# Altium project USB_Oscilloscope.PrjPcb (part 1 of 2)
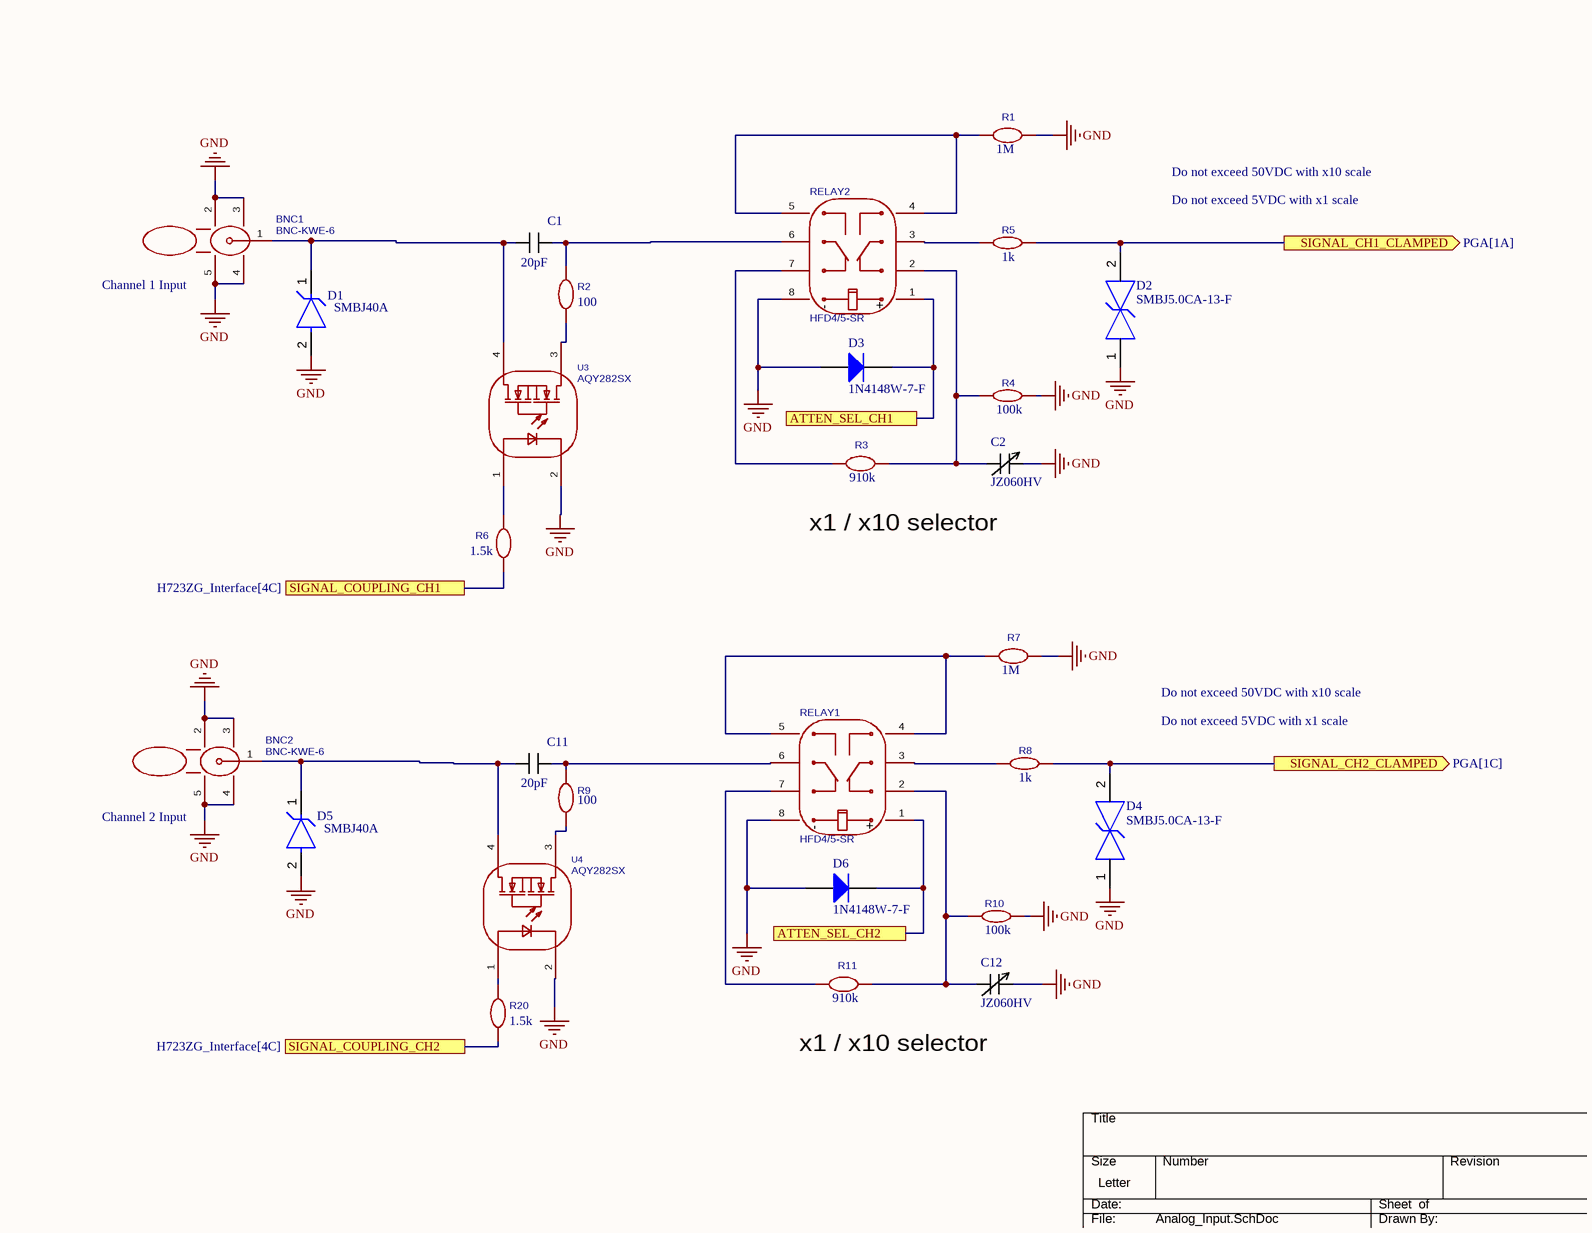
[diagram p0: Analog_Input.SchDoc]
6 sheets, 112 parts. Net scope: global (net labels, ports and power ports of the same name join across sheets).
Board file: USB_Oscilloscope.PcbDoc
Sheets:
  Analog_Input.SchDoc
  PGA.SchDoc
  REF_VOLTAGE_RELAY_DRIVER.SchDoc
  LPF.SchDoc
  Trigger.SchDoc
  H723ZG_Interface.SchDoc

## Sheet Analog_Input.SchDoc: Test
size Letter; SheetNumber: 1; SheetTotal: 6; Project: USB Oscope; ENG_APP_DATE: --/--/--; DSN_APP_DATE: --/--/--; CHK_APP_DATE: --/--/--

### Parts
BNC1  BNC-KWE-6  [CONN-TH_BNC-KWE-6]
BNC2  BNC-KWE-6  [CONN-TH_BNC-KWE-6]
C1  value 20pF  [CAPCP2012X150N]  (hidden comment: TCC0805COG200J500BT)
C2  JZ060HV  [CAPCP4914X60N]
C11  value 20pF  [CAPCP2012X150N]  (hidden comment: Capacitor)
C12  JZ060HV  [CAPCP4914X60N]
D1  SMBJ40A  [FP-SMBJ-MFG]
D2  SMBJ5.0CA-13-F  [FP-SMB-CA-MFG]
D3  1N4148W-7-F  [DIOD-SOD123-2_V]
D4  SMBJ5.0CA-13-F  [FP-SMB-CA-MFG]
D5  SMBJ40A  [FP-SMBJ-MFG]
D6  1N4148W-7-F  [DIOD-SOD123-2_V]
R1  value 1M  [R0805]  (hidden comment: RT0805BRD0710K1L)
R2  value 100  [R0805]  (hidden comment: RT0805BRD0710K1L)
R3  value 910k  [R0805]  (hidden comment: RT0805BRD0710K1L)
R4  value 100k  [R0805]  (hidden comment: 0805W8F0000T5E_C17477)
R5  value 1k  [R0805]  (hidden comment: 0805W8F0000T5E_C17477)
R6  value 1.5k  [R0805]  (hidden comment: RT0805BRD0710K1L)
R7  value 1M  [R0805]  (hidden comment: RT0805BRD0710K1L)
R8  value 1k  [R0805]  (hidden comment: 0805W8F0000T5E_C17477)
R9  value 100  [R0805]  (hidden comment: RT0805BRD0710K1L)
R10  value 100k  [R0805]  (hidden comment: 0805W8F0000T5E_C17477)
R11  value 910k  [R0805]  (hidden comment: RT0805BRD0710K1L)
R20  value 1.5k  [R0805]  (hidden comment: RT0805BRD0710K1L)
RELAY1  HFD4/5-SR  [RELAY-SMD_HFD4-5-SR]
RELAY2  HFD4/5-SR  [RELAY-SMD_HFD4-5-SR]
U3  AQY282SX  [SOP-4_L4.3-W4.4-P2.54-LS7.0-BL]
U4  AQY282SX  [SOP-4_L4.3-W4.4-P2.54-LS7.0-BL]

### Ports
ATTEN_SEL_CH1 (see REF_VOLTAGE_RELAY_DRIVER[1C]), ATTEN_SEL_CH2 (see REF_VOLTAGE_RELAY_DRIVER[1D]), SIGNAL_CH1_CLAMPED (out, see PGA[1A]), SIGNAL_CH2_CLAMPED (out, see PGA[1C]), SIGNAL_COUPLING_CH1 (see H723ZG_Interface[4C]), SIGNAL_COUPLING_CH2 (see H723ZG_Interface[4C])

### Nets
GND: BNC1.2 BNC1.3 BNC1.4 BNC1.5 BNC2.2 BNC2.3 BNC2.4 BNC2.5 C2.2 C12.2 D1.2(A) D2.1 D3.1(A) D4.1 D5.2(A) D6.1(A) R1.1 R4.1 R7.1 R10.1 RELAY1.8 RELAY2.8 U3.2 U4.2
ATTEN_SEL_CH1: D3.2(K) RELAY2.1 ; port ATTEN_SEL_CH1
ATTEN_SEL_CH2: D6.2(K) RELAY1.1 ; port ATTEN_SEL_CH2
SIGNAL_CH1_CLAMPED: D2.2 R5.1 ; port SIGNAL_CH1_CLAMPED
SIGNAL_CH2_CLAMPED: D4.2 R8.1 ; port SIGNAL_CH2_CLAMPED
SIGNAL_COUPLING_CH1: R6.1 ; port SIGNAL_COUPLING_CH1
SIGNAL_COUPLING_CH2: R20.1 ; port SIGNAL_COUPLING_CH2
NetBNC1_1: BNC1.1 C1.1 D1.1(C) U3.4
NetBNC2_1: BNC2.1 C11.1 D5.1(C) U4.4
NetC1_2: C1.2 R2.2 RELAY2.6
NetC2_1: C2.1 R3.1 R4.2 RELAY2.2
NetC11_2: C11.2 R9.2 RELAY1.6
NetC12_1: C12.1 R10.2 R11.1 RELAY1.2
NetR1_2: R1.2 RELAY2.4 RELAY2.5
NetR2_1: R2.1 U3.3
NetR3_2: R3.2 RELAY2.7
NetR5_2: R5.2 RELAY2.3
NetR6_2: R6.2 U3.1
NetR7_2: R7.2 RELAY1.4 RELAY1.5
NetR8_2: R8.2 RELAY1.3
NetR9_1: R9.1 U4.3
NetR11_2: R11.2 RELAY1.7
NetR20_2: R20.2 U4.1

### Notes on the sheet
- Do not exceed 50VDC with x10 scale
- Do not exceed 5VDC with x1 scale
- (near BNC1) Channel 1 Input
- x1 / x10 selector
- (near BNC2) Channel 2 Input
- THIS DOCUMENT AND THE DATA DISCLOSED HEREIN OR
- HEREWITH IS THE PROPERTY OF ALTIUM LIMITED AND MAY
- DWG NO:
- REVISION
- REV:
- DESCRIPTION
- DATE
- APPROVED
- BE FREELY DISTRIBUTED IN WHOLE. NO RIGHTS ARE
- RESERVED OR EXPRESS OR IMPLIED WARANTEE GIVEN.
- ENG:
- APPROVALS
- PROJECT
- DSN:
- CHK:
- REFERENCE DOCUMENTS
- PROJECT REVISION:
- TITLE
- DOCUMENT REVISION:
- DESIGN ITEM:
- BOM:
- FAB DWG:
- PCB DWG:
- ASSY DWG:
- SCALE:
- A3
- SIZE
- CAGE CODE
- FILE NAME
- DWG NO.
- SHEET
- OF
- REV
- (in symbol CMP-006-000000-2) -; +

### Library data of the parts
BNC1 BNC2 = CMP-004-000000-4: Connector Type:Board Side Interface:Inner Bore Number of Ports:1 Interface Length/Height:12mm Frequency:6GHz RF Series:BNC Impedance:50Ω Style:Bent tip; Manufacturer: cntitle(中戈泰斗); Number of Ports: 1; Value: 6GHz; 3D Model Transform: 531.016,1338.97378,0,0,0,0,0,-470.511,-149.606; Impedance: 50Ω; 3D Model: 1ee7285c1b8f4c589de2df097266f005聨0819f05c4eef4c71ace90d822a990e87; AddInBom: yes; RF Series: BNC; Interface Length/Height: 12mm; Source: P1.SCHLIB; Symbol: BNC-KWE-6; LCSC Part Name: 内孔 BNC 弯头; Style: Bent tip; Interface: Inner Bore; Connector Type: Board Side; FootprintName: CONN-TH_BNC-KWE-6; Datasheet: https://item.szlcsc.com/datasheet/BNC-KWE-6/21743971.html; Device: BNC-KWE-6; ModelName: CONN-TH_BNC-KWE-6; Supplier Footprint: 弯插; ConvertToPcb: yes; JLCPCB Part Class: Extended Part; Design Item ID: BNC-KWE-6; Manufacturer Part Number: BNC-KWE-6; Supplier Part Number: C20415789
C1 = CMP-00003-4: Mlcc 20PF ±5% C0G(NP0) 50V 0805; Manufacturer: CCTC; Supplier Part Number: C5375851; Supplier: JLCPCB; Manufacturer Part Number: TCC0805COG200J500BT
C2 C12 = CMP-00011-9: Variable Capacitor, 350V, 2pF Min, 6pF Max, Vertical Adjuster, Surface Mount; Voltage Rating (DC): 125V; Case/Package: 1813; Max Operating Temperature: 85°C; Min Operating Temperature: -40°C; Mounting Technology: Surface Mount; Height: 1.45mm; Width: 3.2mm; RoHS: Compliant; REACH SVHC: Yes; Lifecycle Status: Production; Length: 4.5mm
C11 = CMP-00003-4: Mlcc 20PF ±5% C0G(NP0) 50V 0805; Manufacturer: CCTC; Manufacturer Part Number: TCC0805COG200J500BT; Supplier Part Number: C5375851; Supplier: JLCPCB
D1 D5 = CMP-08607-000120-1: TVS DIODE 40VWM 64.5VC DO214AA; Peak Pulse Power: 600W; Min Breakdown Voltage: 44.4V; Number of Unidirectional Channels: 1; Voltage Rating (DC): 40V; Max Reverse Leakage Current: 1uA; Peak Pulse Current: 9.3A; Element Configuration: Single; Direction: Unidirectional; Max Breakdown Voltage: 49.1V; Power Line Protection: No; Test Current: 1mA; Clamping Voltage-Max: 64.5V; Diode Type: ZENER; Max Power Dissipation: 5W; Reverse Breakdown Voltage: 44.4V; Packaging: Tape and Reel; Width: 3.94mm; Package Quantity: 3000; Resistor Type: Zener; Lead Free: Lead Free; Case/Package: DO-214AA; RoHS Compliant: Yes; Series: SMBJ; Max Surge Current: 9.3A; Termination: SMD/SMT; Number of Pins: 2; Length: 4.57mm; Max Operating Temperature: 150°C; Polarity: Unidirectional; Breakdown Voltage: 44.4V; Height: 2.237mm; Mount: Surface Mount; Power Dissipation: 600W; Number of Channels: 1; Operating Supply Voltage: 40V; Clamping Voltage: 64.5V; Number of Elements: 1; Min Operating Temperature: -55°C; Reverse Standoff Voltage: 40V; Leakage Current: 1uA
D2 D4 = CMP-12828-000012-1: TVS DIODE 5V 9.2V SMB; Manufacturer: Diodes Inc; Peak Pulse Power: 600W; Direction: Bidirectional; Max Junction Temp: +150°C; Number Of Channels: 1; Peak Pulse Current: 65.2A; Breakdown Voltage: 6.4V; Standoff Height: 0.05mm; Device Class L2: TVS Diodes; Temperature: -55°C to +150°C; Digikey Description: TVS DIODE 5V 9.2V SMB; Manufacturer Part Number: SMBJ5.0CA-13-F; Octopart: https://octopart.com/smbj5.0ca-13-f-diodes+inc.-13025192; Mouser Description: TVS Diodes - Transient Voltage Suppressors 600W 5.0V; Temperature Range Low: -55°C; Reverse Standoff Voltage: 5V; Category: Diode; Lead Free: Yes; Device Class L3: unset; Footprint Url: https://www.diodes.com/assets/Package-Files/SMB.pdf; Clamping Voltage: 9.2V; Package: SMB-CA; Height: 2.5mm; Temperature Range High: +150°C; ComponentLink2Description: Datasheet; ComponentLink2URL: https://www.diodes.com/assets/Datasheets/ds19002.pdf; Automotive: No; Device Class L1: Circuit Protection; RoHS: TRUE
D3 D6 = CMP-2000-04932-2: Fast Switching Diode, 100 V, 0.15 A, -65 to 150 degC, 2-Pin?SOD123, RoHS, Tape and Reel; Manufacturer: Diodes Inc; Recovery Time: 4ns; Unit Weight: 0.000353oz; Max Surge Current: 2A; Peak Reverse Voltage: 100V; Ir - Reverse Current: 1uA; Vf - Forward Voltage: 1.25V; Configuration: Single; If - Forward Current: 0.15A; Product Category: Diodes-GeneralPurpose,Power,Switching; Operating Temperature Range: -65Cto+150C; Packaging: Reel; Manufacturer URL: http://www.diodes.com/; Maximum Operating Temperature: +150C; Height: 1.25mm; Minimum Operating Temperature: -65C; Product: SwitchingDiodes; Package URL: http://www.diodes.com/datasheets/ds18004.pdf; Type: SwitchingDiode; Package Reference: SOD123-2; Width: 1.7mm; Datasheet URL: http://www.farnell.com/datasheets/1915529.pdf; Datasheet Version: Rev. 24-2, 10/2013; Series: 1N4148; Factory Pack Quantity: 3000; Length: 2.85mm; RoHS: True; Mounting Style: SMD/SMT; Package / Case: SOD-123
R1 R7 = CMP-016-000007-1: Type:Thick Film Resistor Resistance:1MΩ Tolerance:±1% Tolerance:±1% Power(Watts):125mW Voltage-Supply(Max):150V Temperature Coefficient:±100ppm/℃ Temperature Coefficient:±100ppm/℃ Operating Temperature:-55℃~+155℃ Operating Temperature:-55℃~+155℃; Manufacturer: FOJAN(富捷); AddInBom: yes; Device: FRC0805F1004TS; ModelId: b83c7c5430874b8eb2319a65d9433429聨0819f05c4eef4c71ace90d822a990e87; ModelName: R0805_L2.0-W1.3-H0.6; ModelTransform: 78.74,51.181,0,0,0,0,0,-0.0005,0; Power(Watts): 125mW; Tolerance: 1%; Voltage-Supply(Max): 150V; ConvertToPcb: yes; Design Item ID: FRC0805F1004TS; FootprintName: R0805; JLCPCB Part Class: Extended Part; LCSC Part Name: 1MΩ ±1% 125mW 厚膜电阻; Operating Temperature: -55℃~+155℃; Source: P1.SCHLIB; Supplier Footprint: 0805; Symbol: FRC0805F1004TS; Temperature Coefficient: ±100ppm/℃; Type: Thick Film Resistor; Manufacturer Part Number: FRC0805F1004TS; Supplier Part Number: C2933280
R2 R9 = CMP-016-000006-1: Type:Thick Film Resistor Resistance:100Ω Tolerance:±1% Tolerance:±1% Power(Watts):125mW Voltage-Supply(Max):150V Temperature Coefficient:±100ppm/℃ Temperature Coefficient:±100ppm/℃ Operating Temperature:-55℃~+155℃ Operating Temperature:-55℃~+155℃; Manufacturer: FOJAN(富捷); AddInBom: yes; Device: FRC0805F1000TS; ModelId: b83c7c5430874b8eb2319a65d9433429聨0819f05c4eef4c71ace90d822a990e87; ModelName: R0805_L2.0-W1.3-H0.6; ModelTransform: 78.74,51.181,0,0,0,0,0,-0.0005,0; Power(Watts): 125mW; Tolerance: 1%; Voltage-Supply(Max): 150V; ConvertToPcb: yes; Datasheet: https://item.szlcsc.com/datasheet/FRC0805F1000TS/3180731.html; Design Item ID: FRC0805F1000TS; FootprintName: R0805; JLCPCB Part Class: Extended Part; LCSC Part Name: 100Ω ±1% 125mW 厚膜电阻; Operating Temperature: -55℃~+155℃; Source: P1.SCHLIB; Supplier Footprint: 0805; Symbol: FRC0805F1000TS; Temperature Coefficient: ±100ppm/℃; Type: Thick Film Resistor; Manufacturer Part Number: FRC0805F1000TS; Supplier Part Number: C2907218
R3 R11 = CMP-016-000015-1: Type:Thick Film Resistor Resistance:910kΩ Tolerance:±1% Tolerance:±1% Power(Watts):125mW Voltage-Supply(Max):150V Temperature Coefficient:±100ppm/℃ Temperature Coefficient:±100ppm/℃ Operating Temperature:-55℃~+155℃ Operating Temperature:-55℃~+155℃; Manufacturer: FOJAN(富捷); AddInBom: yes; Device: FRC0805F9103TS; ModelId: b83c7c5430874b8eb2319a65d9433429聨0819f05c4eef4c71ace90d822a990e87; ModelName: R0805_L2.0-W1.3-H0.6; ModelTransform: 78.74,51.181,0,0,0,0,0,-0.0005,0; Power(Watts): 125mW; Tolerance: 1%; Voltage-Supply(Max): 150V; ConvertToPcb: yes; Design Item ID: FRC0805F9103TS; FootprintName: R0805; JLCPCB Part Class: Extended Part; LCSC Part Name: 910kΩ ±1% 125mW 厚膜电阻; Operating Temperature: -55℃~+155℃; Source: P1.SCHLIB; Supplier Footprint: 0805; Symbol: FRC0805F9103TS; Temperature Coefficient: ±100ppm/℃; Type: Thick Film Resistor; Manufacturer Part Number: FRC0805F9103TS; Supplier Part Number: C2999461
R4 R10 = CMP-016-000003-1: Type:Thick Film Resistor Resistance:100kΩ Tolerance:±1% Tolerance:±1% Power(Watts):125mW Voltage-Supply(Max):150V Temperature Coefficient:±100ppm/℃ Temperature Coefficient:±100ppm/℃ Operating Temperature:-55℃~+155℃ Operating Temperature:-55℃~+155℃; Manufacturer: UNI-ROYAL(厚声); AddInBom: yes; Device: 0805W8F1003T5E; ModelId: b83c7c5430874b8eb2319a65d9433429聨0819f05c4eef4c71ace90d822a990e87; ModelName: R0805_L2.0-W1.3-H0.6; ModelTransform: 78.74,51.181,0,0,0,0,0,-0.0005,0; Power(Watts): 125mW; Symbol: 0805W8F1003T5E_C149504; Tolerance: 1%; Voltage-Supply(Max): 150V; ConvertToPcb: yes; Datasheet: https://item.szlcsc.com/datasheet/0805W8F1003T5E/160838.html; Design Item ID: 0805W8F1003T5E; FootprintName: R0805; JLCPCB Part Class: Basic Part; LCSC Part Name: 100kΩ ±1% 125mW 厚膜电阻; Operating Temperature: -55℃~+155℃; Source: P1.SCHLIB; Supplier Footprint: 0805; Temperature Coefficient: ±100ppm/℃; Type: Thick Film Resistor; Manufacturer Part Number: 0805W8F1003T5E; Supplier Part Number: C149504
R5 R8 = CMP-016-000001-1: Type:Thick Film Resistors Resistance:1kΩ Tolerance:±1% Tolerance:±1% Power(Watts): Overload Voltage (Max): Temperature Coefficient:±100ppm/℃ Temperature Coefficient:±100ppm/℃ Operating Temperature Range:-55℃~+155℃ Operating Temperature Range:-55℃~+155℃; Manufacturer: UNI-ROYAL(厚声); AddInBom: yes; Device: 0805W8F1001T5E; ModelId: b83c7c5430874b8eb2319a65d9433429聨0819f05c4eef4c71ace90d822a990e87; ModelName: R0805_L2.0-W1.3-H0.6; ModelTransform: 78.74,51.181,0,0,0,0,0,-0.0005,0; Tolerance: 1%; ConvertToPcb: yes; Datasheet: https://atta.szlcsc.com/upload/public/pdf/source/20200306/C422600_1E6D84923E4A46A82E41ADD87F860B5C.pdf; Design Item ID: 0805W8F1001T5E; FootprintName: R0805; JLCPCB Part Class: Basic Part; LCSC Part Name: 1kΩ ±1% 125mW 厚膜电阻; Operating Temperature Range: -55℃~+155℃; Source: P1.SCHLIB; Supplier Footprint: 0805; Symbol: 0805W8F1001T5E; Temperature Coefficient: ±100ppm/℃; Type: Thick Film Resistors; Manufacturer Part Number: 0805W8F1001T5E; Supplier Part Number: C17513
R6 R20 = CMP-016-000009-1: Type:Thick Film Resistor Resistance:1.5kΩ Tolerance:±1% Tolerance:±1% Power(Watts):125mW Voltage-Supply(Max):150V Temperature Coefficient:±100ppm/℃ Temperature Coefficient:±100ppm/℃ Operating Temperature:-55℃~+155℃ Operating Temperature:-55℃~+155℃; Manufacturer: FOJAN(富捷); AddInBom: yes; Device: FRC0805F1501TS; ModelId: b83c7c5430874b8eb2319a65d9433429聨0819f05c4eef4c71ace90d822a990e87; ModelName: R0805_L2.0-W1.3-H0.6; ModelTransform: 78.74,51.181,0,0,0,0,0,-0.0005,0; Power(Watts): 125mW; Tolerance: 1%; Voltage-Supply(Max): 150V; ConvertToPcb: yes; Design Item ID: FRC0805F1501TS; FootprintName: R0805; JLCPCB Part Class: Extended Part; LCSC Part Name: 1.5kΩ ±1% 125mW 厚膜电阻; Operating Temperature: -55℃~+155℃; Source: P1.SCHLIB; Supplier Footprint: 0805; Symbol: FRC0805F1501TS; Temperature Coefficient: ±100ppm/℃; Type: Thick Film Resistor; Manufacturer Part Number: FRC0805F1501TS; Supplier Part Number: C2907216
RELAY1 RELAY2 = CMP-006-000000-2: Coil Voltage:5V Contact Form:2 Form C: 2C (DPDT-CO) Number of Pins:8 Contact Rating:1A@30VDC；300mA@125VAC Switching Voltage(Max):250V@AC；220V@DC Contact Material:AgNi + Gold plated Coil Rated Power:140mW Coil Resistance:178Ω Switching Current(Max):2A Oper; Manufacturer: HF(宏发); Release Time: 3ms; Coil Voltage: 5V; Coil Type: Polarized-Single Coil; AddInBom: yes; ModelName: RELAY-SMD_L10.0-W6.5-H5.7-LS7.5-P2.2; ModelTransform: 393.7,307.086,0,0,0,0,-0.005,0,0; ModelId: abc4320b17a04819849f22b1ebcd3fe7聨0819f05c4eef4c71ace90d822a990e87; Switching Current(Max): 2A; Coil Resistance: 178Ω; Coil Rated Power: 140mW; Contact Resistance: 100mΩ; Contact Rating: 1A@30VDC；300mA@125VAC; Symbol: HFD4/5-S; JLCPCB Part Class: Extended Part; Operating Temperature: -40℃~+85℃; ConvertToPcb: yes; FootprintName: RELAY-SMD_HFD4-5-SR; Supplier Footprint: SMD,10x6.5mm; Device: HFD4/5-SR; Switching Voltage(Max): 250V@AC；220V@DC; Contact Form: 2 Form C: 2C (DPDT-CO); Datasheet: https://item.szlcsc.com/datasheet/HFD4%252F5-SR/65466.html; Contact Material: AgNi + Gold plated; Design Item ID: HFD4/5-SR; Number of Pins: 8; LCSC Part Name: 超小型5V继电器 双刀双掷; Source: P1.SCHLIB; Operate Time: 3ms; Manufacturer Part Number: HFD4/5-SR; Supplier Part Number: C64399
U3 U4 = CMP-006-000003-2: Contact Form:SPST-NO(1 Form A) Load Current:500mA Load Voltage:60V Load Voltage:60V Voltage - Forward(Vf):1.25V Forward Current(If):50mA RDS(on):850mΩ Isolation Voltage(Vrms):1.5kV Turn-on time:900us Turn-off time:500us Input Type:AC,DC Operating Temperat; Manufacturer: PANASONIC(松下); Insulation Resistance: 1000MΩ; Load Voltage: 60V; Turn-on time: 900us; RDS(on): 850mΩ; Forward Current(If): 50mA; Isolation Voltage(Vrms): 1.5kV; Total Power Dissipation(Pd): 350mW; ModelName: SOP-4_L4.4-W4.6-H2.1-LS7.0-P2.54; ConvertToPcb: yes; Voltage - Forward(Vf): 1.25V; Turn-off time: 500us; Input Type: AC,DC; ModelId: 43a8e8732de74b24a167faf554c5dad4聨0819f05c4eef4c71ace90d822a990e87; ModelTransform: 173.228,283.69762,0,0,0,0,0,0.005,0; Load Current: 500mA; Datasheet: https://item.szlcsc.com/datasheet/AQY282SX/246604.html; Source: P1.SCHLIB; Symbol: AQY282SX; FootprintName: SOP-4_L4.3-W4.4-P2.54-LS7.0-BL; Design Item ID: AQY282SX; Contact Form: SPST-NO(1 Form A); Operating Temperature: -40℃~+85℃; Device: AQY282SX; LCSC Part Name: 1 Form A(SPSTNO) 负载AC,DC 负载电压60V; AddInBom: yes; JLCPCB Part Class: Extended Part; Supplier Footprint: SOP-4-2.54mm; Manufacturer Part Number: AQY282SX; Supplier Part Number: C250827

## Sheet PGA.SchDoc
size A; SheetNumber: 2; SheetTotal: 6
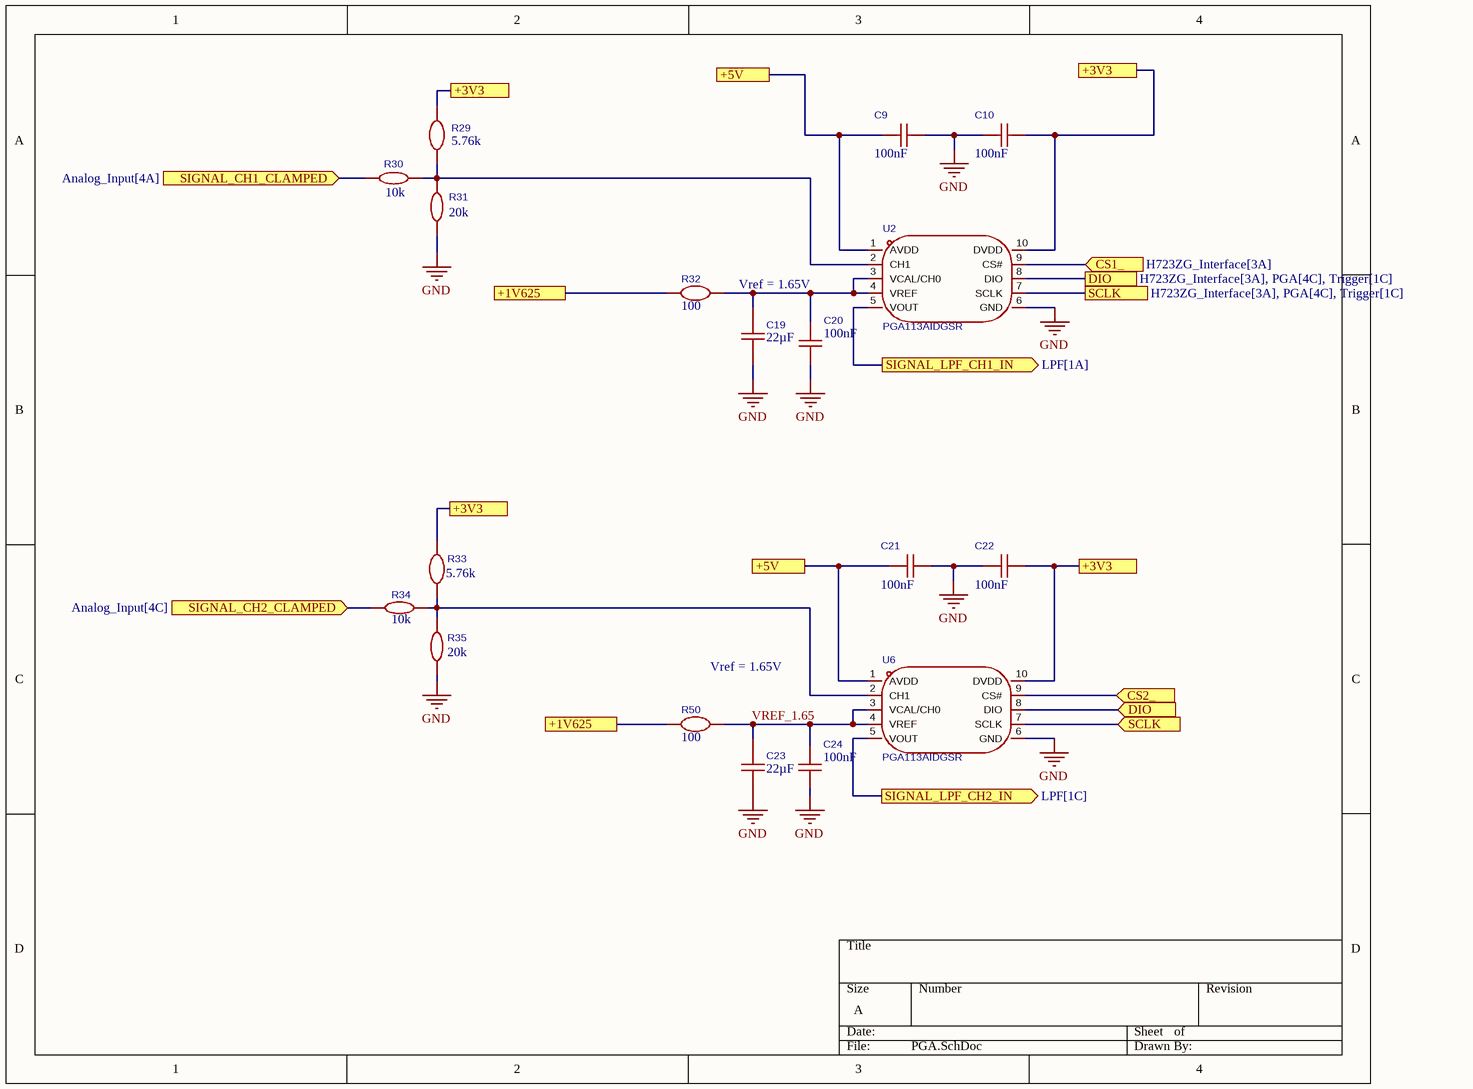
[diagram p1: PGA.SchDoc]

### Parts
C9  value 100nF  [C0805]  (hidden comment: 0805CG6R0C500NT_C67560)
C10  value 100nF  [C0805]  (hidden comment: 0805CG6R0C500NT_C67560)
C19  value 22µF  [C0805]  (hidden comment: TCC0805X5R226K100FT)
C20  value 100nF  [C0805]  (hidden comment: 0805CG6R0C500NT_C67560)
C21  value 100nF  [C0805]  (hidden comment: 0805CG6R0C500NT_C67560)
C22  value 100nF  [C0805]  (hidden comment: 0805CG6R0C500NT_C67560)
C23  value 22µF  [C0805]  (hidden comment: TCC0805X5R226K100FT)
C24  value 100nF  [C0805]  (hidden comment: 0805CG6R0C500NT_C67560)
R29  value 5.76k  [R0805]  (hidden comment: RT0805BRD0710K1L)
R30  value 10k  [R0805]  (hidden comment: 0805W8F0000T5E_C17477)
R31  value 20k  [R0805]  (hidden comment: 0805W8F0000T5E_C17477)
R32  value 100  [R0805]  (hidden comment: RT0805BRD0710K1L)
R33  value 5.76k  [R0805]  (hidden comment: RT0805BRD0710K1L)
R34  value 10k  [R0805]  (hidden comment: 0805W8F0000T5E_C17477)
R35  value 20k  [R0805]  (hidden comment: 0805W8F0000T5E_C17477)
R50  value 100  [R0805]  (hidden comment: RT0805BRD0710K1L)
U2  PGA113AIDGSR  [VSSOP-10_L3.0-W3.0-P0.50-LS4.9-BL]
U6  PGA113AIDGSR  [VSSOP-10_L3.0-W3.0-P0.50-LS4.9-BL]

### Ports
+1V625 (see PGA[2B], REF_VOLTAGE_RELAY_DRIVER[3A]), +1V625 (see PGA[2C], REF_VOLTAGE_RELAY_DRIVER[3A]), +3V3 (see H723ZG_Interface[1A], PGA[2A], PGA[2B], PGA[4A], REF_VOLTAGE_RELAY_DRIVER[1A], REF_VOLTAGE_RELAY_DRIVER[2B], REF_VOLTAGE_RELAY_DRIVER[2C], REF_VOLTAGE_RELAY_DRIVER[4A], Trigger[1C], Trigger[3A]), +3V3 (see H723ZG_Interface[1A], PGA[2A], PGA[2B], PGA[4C], REF_VOLTAGE_RELAY_DRIVER[1A], REF_VOLTAGE_RELAY_DRIVER[2B], REF_VOLTAGE_RELAY_DRIVER[2C], REF_VOLTAGE_RELAY_DRIVER[4A], Trigger[1C], Trigger[3A]), +3V3 (see H723ZG_Interface[1A], PGA[2A], PGA[4A], PGA[4C], REF_VOLTAGE_RELAY_DRIVER[1A], REF_VOLTAGE_RELAY_DRIVER[2B], REF_VOLTAGE_RELAY_DRIVER[2C], REF_VOLTAGE_RELAY_DRIVER[4A], Trigger[1C], Trigger[3A]), +3V3 (see H723ZG_Interface[1A], PGA[2B], PGA[4A], PGA[4C], REF_VOLTAGE_RELAY_DRIVER[1A], REF_VOLTAGE_RELAY_DRIVER[2B], REF_VOLTAGE_RELAY_DRIVER[2C], REF_VOLTAGE_RELAY_DRIVER[4A], Trigger[1C], Trigger[3A]), +5V (see H723ZG_Interface[1A], PGA[3A], REF_VOLTAGE_RELAY_DRIVER[2C], REF_VOLTAGE_RELAY_DRIVER[3B], Trigger[2B], Trigger[4A]), +5V (see H723ZG_Interface[1A], PGA[3C], REF_VOLTAGE_RELAY_DRIVER[2C], REF_VOLTAGE_RELAY_DRIVER[3B], Trigger[2B], Trigger[4A]), CS1_ (in, see H723ZG_Interface[3A]), CS2_ (in, see H723ZG_Interface[3A]), DIO (in, see H723ZG_Interface[3A], PGA[4B], Trigger[1C]), DIO (see H723ZG_Interface[3A], PGA[4C], Trigger[1C]), SCLK (in, see H723ZG_Interface[3A], PGA[4B], Trigger[1C]), SCLK (see H723ZG_Interface[3A], PGA[4C], Trigger[1C]), SIGNAL_CH1_CLAMPED (in, see Analog_Input[4A]), SIGNAL_CH2_CLAMPED (in, see Analog_Input[4C]), SIGNAL_LPF_CH1_IN (out, see LPF[1A]), SIGNAL_LPF_CH2_IN (out, see LPF[1C])

### Nets
GND: C9.1 C10.2 C19.2 C20.1 C21.1 C22.2 C23.2 C24.1 R31.2 R35.2 U2.6(GND) U6.6(GND)
+1V625: R32.1 R50.1 ; port +1V625
+3V3: C10.1 C22.1 R29.1 R33.1 U2.10(DVDD) U6.10(DVDD) ; port +3V3
+5V: C9.2 C21.2 U2.1(AVDD) U6.1(AVDD) ; port +5V
CS1_: U2.9(CS#) ; port CS1_
CS2_: U6.9(CS#) ; port CS2_
DIO: U2.8(DIO) U6.8(DIO) ; port DIO
SCLK: U2.7(SCLK) U6.7(SCLK) ; port SCLK
SIGNAL_CH1_CLAMPED: R30.2 ; port SIGNAL_CH1_CLAMPED
SIGNAL_CH2_CLAMPED: R34.2 ; port SIGNAL_CH2_CLAMPED
SIGNAL_LPF_CH1_IN: U2.5(VOUT) ; port SIGNAL_LPF_CH1_IN
SIGNAL_LPF_CH2_IN: U6.5(VOUT) ; port SIGNAL_LPF_CH2_IN
VREF_1.65: C23.1 C24.2 R50.2 U6.3(VCAL/CH0) U6.4(VREF)
NetC19_1: C19.1 C20.2 R32.2 U2.3(VCAL/CH0) U2.4(VREF)
NetR29_2: R29.2 R30.1 R31.1 U2.2(CH1)
NetR33_2: R33.2 R34.1 R35.1 U6.2(CH1)

### Notes on the sheet
- Vref = 1.65V

### Library data of the parts
C9 C10 C20-C22 C24 = CMP-015-000003-2: Capacitance:100nF Tolerance:±5% Tolerance:±5% Voltage Rating:50V Temperature Coefficient:X7R; Manufacturer: YAGEO(国巨); AddInBom: yes; Device: CC0805JRX7R9BB104; ModelId: 8c88e81f49c6409b980720ec8953afb6聨0819f05c4eef4c71ace90d822a990e87; ModelName: C0805_L2.0-W1.3-H1.3; ModelTransform: 78.74,51.181,0,0,0,0,0,0.0005,0; Temperature Coefficient: X7R; Tolerance: 5%; Voltage Rating: 50V; ConvertToPcb: yes; Datasheet: https://item.szlcsc.com/datasheet/CC0805JRX7R9BB104/112720.html; Design Item ID: CC0805JRX7R9BB104; FootprintName: C0805; JLCPCB Part Class: Extended Part; LCSC Part Name: 100nF ±5% 50V; Source: P1.SCHLIB; Supplier Footprint: 0805; Symbol: CC0805JRX7R9BB104; Manufacturer Part Number: CC0805JRX7R9BB104; Supplier Part Number: C111492
C19 C23 = CMP-015-000005-1: Capacitance:22uF Tolerance:±10% Tolerance:±10% Voltage Rating:10V Temperature Coefficient:X5R; Manufacturer: CCTC(三环); AddInBom: yes; ModelId: 8c88e81f49c6409b980720ec8953afb6聨0819f05c4eef4c71ace90d822a990e87; ModelName: C0805_L2.0-W1.3-H1.3; ModelTransform: 78.74,51.181,0,0,0,0,0,0.0005,0; Temperature Coefficient: X5R; Tolerance: 10%; Voltage Rating: 10V; ConvertToPcb: yes; Datasheet: https://item.szlcsc.com/datasheet/TCC0805X5R226K100FT/352741.html; Design Item ID: TCC0805X5R226K100FT; Device: TCC0805X5R226K100FT; FootprintName: C0805; JLCPCB Part Class: Extended Part; LCSC Part Name: 22uF ±10% 10V; Source: P1.SCHLIB; Supplier Footprint: 0805; Symbol: TCC0805X5R226K100FT; Manufacturer Part Number: TCC0805X5R226K100FT; Supplier Part Number: C380336
R29 R33 = CMP-016-000013-1: Type:Thick Film Resistor Resistance:5.76kΩ Tolerance:±1% Tolerance:±1% Power(Watts):125mW Voltage-Supply(Max):150V Temperature Coefficient:±100ppm/℃ Temperature Coefficient:±100ppm/℃ Operating Temperature:-55℃~+155℃ Operating Temperature:-55℃~+155℃; Manufacturer: FOJAN(富捷); AddInBom: yes; Device: FRC0805F5761TS; ModelId: b83c7c5430874b8eb2319a65d9433429聨0819f05c4eef4c71ace90d822a990e87; ModelName: R0805_L2.0-W1.3-H0.6; ModelTransform: 78.74,51.181,0,0,0,0,0,-0.0005,0; Power(Watts): 125mW; Tolerance: 1%; Voltage-Supply(Max): 150V; ConvertToPcb: yes; Design Item ID: FRC0805F5761TS; FootprintName: R0805; JLCPCB Part Class: Extended Part; LCSC Part Name: 5.76kΩ ±1% 125mW 厚膜电阻; Operating Temperature: -55℃~+155℃; Source: P1.SCHLIB; Supplier Footprint: 0805; Symbol: FRC0805F5761TS; Temperature Coefficient: ±100ppm/℃; Type: Thick Film Resistor; Manufacturer Part Number: FRC0805F5761TS; Supplier Part Number: C3000533
R30 R34 = CMP-016-000002-1: Type:Thick Film Resistor Resistance:10kΩ Tolerance:±1% Tolerance:±1% Power(Watts):125mW Voltage-Supply(Max):150V Temperature Coefficient:±100ppm/℃ Temperature Coefficient:±100ppm/℃ Operating Temperature:-55℃~+155℃ Operating Temperature:-55℃~+155℃; Manufacturer: UNI-ROYAL(厚声); AddInBom: yes; Device: 0805W8F1002T5E; ModelId: b83c7c5430874b8eb2319a65d9433429聨0819f05c4eef4c71ace90d822a990e87; ModelName: R0805_L2.0-W1.3-H0.6; ModelTransform: 78.74,51.181,0,0,0,0,0,-0.0005,0; Power(Watts): 125mW; Tolerance: 1%; Voltage-Supply(Max): 150V; ConvertToPcb: yes; Datasheet: https://item.szlcsc.com/datasheet/0805W8F1002T5E/18102.html; Design Item ID: 0805W8F1002T5E; FootprintName: R0805; JLCPCB Part Class: Basic Part; LCSC Part Name: 10kΩ ±1% 125mW 厚膜电阻; Operating Temperature: -55℃~+155℃; Source: P1.SCHLIB; Supplier Footprint: 0805; Symbol: 0805W8F1002T5E; Temperature Coefficient: ±100ppm/℃; Type: Thick Film Resistor; Manufacturer Part Number: 0805W8F1002T5E; Supplier Part Number: C17414
R31 R35 = CMP-016-000005-1: Type:Thick Film Resistors Resistance:20kΩ Tolerance:±1% Tolerance:±1% Power(Watts): Overload Voltage (Max): Temperature Coefficient:±100ppm/℃ Temperature Coefficient:±100ppm/℃ Operating Temperature Range:-55℃~+155℃ Operating Temperature Range:-55℃~+155℃; Manufacturer: UNI-ROYAL(厚声); AddInBom: yes; Device: 0805W8F2002T5E; ModelId: b83c7c5430874b8eb2319a65d9433429聨0819f05c4eef4c71ace90d822a990e87; ModelName: R0805_L2.0-W1.3-H0.6; ModelTransform: 78.74,51.181,0,0,0,0,0,-0.0005,0; Tolerance: 1%; ConvertToPcb: yes; Datasheet: https://atta.szlcsc.com/upload/public/pdf/source/20200306/C422600_1E6D84923E4A46A82E41ADD87F860B5C.pdf; Design Item ID: 0805W8F2002T5E; FootprintName: R0805; JLCPCB Part Class: Basic Part; LCSC Part Name: 20kΩ ±1% 125mW 厚膜电阻; Operating Temperature Range: -55℃~+155℃; Source: P1.SCHLIB; Supplier Footprint: 0805; Symbol: 0805W8F2002T5E; Temperature Coefficient: ±100ppm/℃; Type: Thick Film Resistors; Manufacturer Part Number: 0805W8F2002T5E; Supplier Part Number: C4328
R32 R50 = CMP-016-000006-1: as R2 on sheet Analog_Input; ConvertToPcb: yes; Datasheet: https://item.szlcsc.com/datasheet/FRC0805F1000TS/3180731.html; Design Item ID: FRC0805F1000TS; FootprintName: R0805; JLCPCB Part Class: Extended Part; LCSC Part Name: 100Ω ±1% 125mW 厚膜电阻; Operating Temperature: -55℃~+155℃; Source: P1.SCHLIB; Supplier Footprint: 0805; Symbol: FRC0805F1000TS; Temperature Coefficient: ±100ppm/℃; Type: Thick Film Resistor; Manufacturer Part Number: FRC0805F1000TS; Supplier Part Number: C2907218
U2 U6 = CMP-008-000000-1: Amplifier Type:PGA Number of Channels:2 Rail to Rail:Rail-to-Rail Input；Rail-to-Rail Output Output Current:60mA Current - Supply:1.1mA Operating Temperature:-40℃~+125℃ Operating Temperature:-40℃~+125℃ Vos - Input Offset Voltage:100uV Input Offset Voltage; Manufacturer: TI(德州仪器); ModelId: 3e31ed6b36ca484795e6a68c51b575dc聨0819f05c4eef4c71ace90d822a990e87; Input Offset Current(Ios): 5nA; ModelName: VSSOP-10_L3.0-W3.0-H1.1-LS4.9-P0.50; ConvertToPcb: yes; Input Offset Voltage Drift(Vos TC): 1.2uV/℃; ModelTransform: 197.637,118.11,0,90,0,0,0,0,0; Quiescent Current: 1100000nA; Ib - Input Bias Current: 5000pA; Output Current: 60mA; Number of Channels: 2; Amplifier Type: PGA; Single Supply: 2.2V~5.5V; Current - Supply: 1.1mA; Vos - Input Offset Voltage: 100uV; LCSC Part Name: 零漂移可编程增益放大器; JLCPCB Part Class: Extended Part; Symbol: PGA113AIDGSR; FootprintName: VSSOP-10_L3.0-W3.0-P0.50-LS4.9-BL; Rail to Rail: Rail-to-Rail Input；Rail-to-Rail Output; Design Item ID: PGA113AIDGSR; Source: PGA113AIDGSR.SCHLIB; Supplier Footprint: VSSOP-10-0.5mm; Operating Temperature: -40℃~+125℃; Datasheet: https://www.ti.com/cn/lit/gpn/pga112; AddInBom: yes; Device: PGA113AIDGSR; Manufacturer Part Number: PGA113AIDGSR; Supplier Part Number: C2057394

## Sheet REF_VOLTAGE_RELAY_DRIVER.SchDoc
size A; SheetNumber: 3; SheetTotal: 6
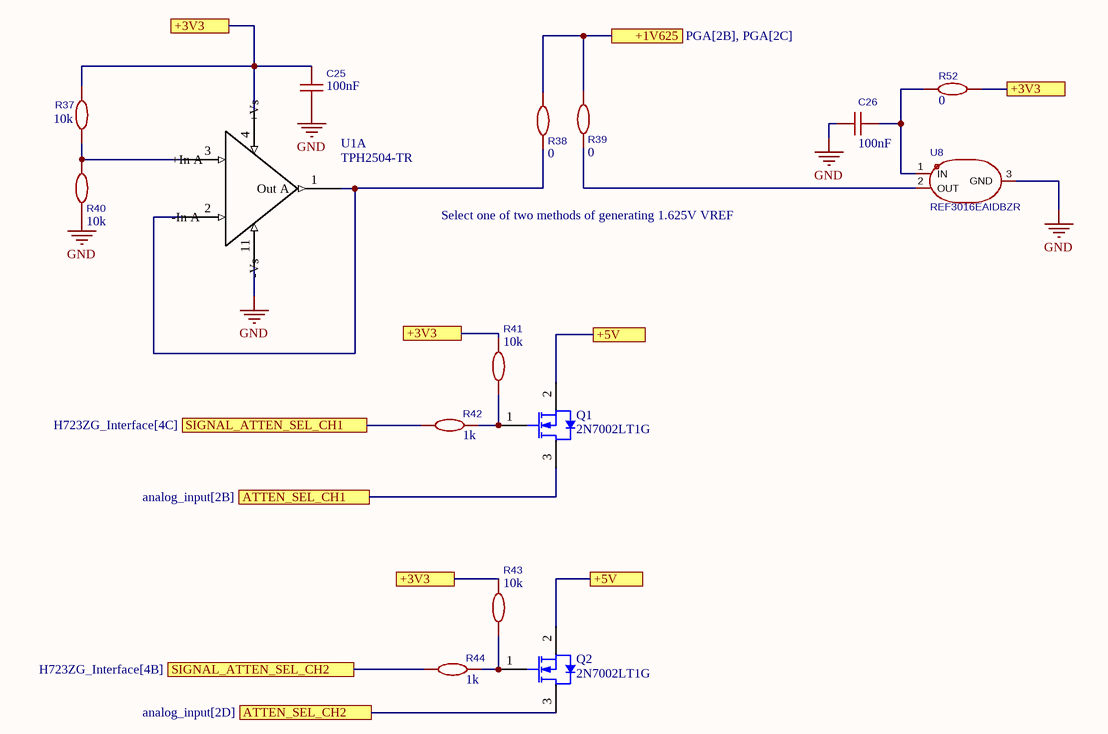
[diagram p2: REF_VOLTAGE_RELAY_DRIVER.SchDoc]

### Parts
C25  value 100nF  [C0805]  (hidden comment: 0805CG6R0C500NT_C67560)
C26  value 100nF  [C0805]  (hidden comment: 0805CG6R0C500NT_C67560)
Q1  2N7002LT1G  [ONSC-SOT-23-3-318-08_V]
Q2  2N7002LT1G  [ONSC-SOT-23-3-318-08_V]
R37  value 10k  [R0805]  (hidden comment: 0805W8F0000T5E_C17477)
R38  value 0  [R0805]  (hidden comment: 0805W8F0000T5E_C17477)
R39  value 0  [R0805]  (hidden comment: 0805W8F0000T5E_C17477)
R40  value 10k  [R0805]  (hidden comment: 0805W8F0000T5E_C17477)
R41  value 10k  [R0805]  (hidden comment: 0805W8F0000T5E_C17477)
R42  value 1k  [R0805]  (hidden comment: 0805W8F0000T5E_C17477)
R43  value 10k  [R0805]  (hidden comment: 0805W8F0000T5E_C17477)
R44  value 1k  [R0805]  (hidden comment: 0805W8F0000T5E_C17477)
R52  value 0  [R0805]  (hidden comment: 0805W8F0000T5E_C17477)
U1  TPH2504-TR  [TSOP65P640X120-14N]  (part A of 4)
U8  REF3016EAIDBZR  [SOT-23-3_L3.0-W1.7-P0.95-LS2.9-BR]

### Ports
+1V625 (see PGA[2B], PGA[2C]), +3V3 (see H723ZG_Interface[1A], PGA[2A], PGA[2B], PGA[4A], PGA[4C], REF_VOLTAGE_RELAY_DRIVER[1A], REF_VOLTAGE_RELAY_DRIVER[2B], REF_VOLTAGE_RELAY_DRIVER[2C], Trigger[1C], Trigger[3A]), +3V3 (see H723ZG_Interface[1A], PGA[2A], PGA[2B], PGA[4A], PGA[4C], REF_VOLTAGE_RELAY_DRIVER[1A], REF_VOLTAGE_RELAY_DRIVER[2B], REF_VOLTAGE_RELAY_DRIVER[4A], Trigger[1C], Trigger[3A]), +3V3 (see H723ZG_Interface[1A], PGA[2A], PGA[2B], PGA[4A], PGA[4C], REF_VOLTAGE_RELAY_DRIVER[1A], REF_VOLTAGE_RELAY_DRIVER[2C], REF_VOLTAGE_RELAY_DRIVER[4A], Trigger[1C], Trigger[3A]), +3V3 (see H723ZG_Interface[1A], PGA[2A], PGA[2B], PGA[4A], PGA[4C], REF_VOLTAGE_RELAY_DRIVER[2B], REF_VOLTAGE_RELAY_DRIVER[2C], REF_VOLTAGE_RELAY_DRIVER[4A], Trigger[1C], Trigger[3A]), +5V (see H723ZG_Interface[1A], PGA[3A], PGA[3C], REF_VOLTAGE_RELAY_DRIVER[2C], Trigger[2B], Trigger[4A]), +5V (see H723ZG_Interface[1A], PGA[3A], PGA[3C], REF_VOLTAGE_RELAY_DRIVER[3B], Trigger[2B], Trigger[4A]), ATTEN_SEL_CH1 (see analog_input[2B]), ATTEN_SEL_CH2 (see analog_input[2D]), SIGNAL_ATTEN_SEL_CH1 (see H723ZG_Interface[4C]), SIGNAL_ATTEN_SEL_CH2 (see H723ZG_Interface[4B])

### Nets
GND: C25.2 C26.1 R40.2 U1.11(-Vs) U8.3(GND)
+1V625: R38.1 R39.1 ; port +1V625
+3V3: C25.1 R37.1 R41.2 R43.2 R52.2 U1.4(+Vs) ; port +3V3
+5V: Q1.2(S) Q2.2(S) ; port +5V
ATTEN_SEL_CH1: Q1.3(D) ; port ATTEN_SEL_CH1
ATTEN_SEL_CH2: Q2.3(D) ; port ATTEN_SEL_CH2
SIGNAL_ATTEN_SEL_CH1: R42.1 ; port SIGNAL_ATTEN_SEL_CH1
SIGNAL_ATTEN_SEL_CH2: R44.1 ; port SIGNAL_ATTEN_SEL_CH2
NetC26_2: C26.2 R52.1 U8.1(IN)
NetQ1_1: Q1.1(G) R41.1 R42.2
NetQ2_1: Q2.1(G) R43.1 R44.2
NetR37_2: R37.2 R40.1 U1.3(+In_A)
NetR38_2: R38.2 U1.1(Out_A) U1.2(-In_A)
NetR39_2: R39.2 U8.2(OUT)

### Notes on the sheet
- Select one of two methods of generating 1.625V VREF

### Library data of the parts
C25 C26 = CMP-015-000003-2: as C9 on sheet PGA; ConvertToPcb: yes; Datasheet: https://item.szlcsc.com/datasheet/CC0805JRX7R9BB104/112720.html; Design Item ID: CC0805JRX7R9BB104; FootprintName: C0805; JLCPCB Part Class: Extended Part; LCSC Part Name: 100nF ±5% 50V; Source: P1.SCHLIB; Supplier Footprint: 0805; Symbol: CC0805JRX7R9BB104; Manufacturer Part Number: CC0805JRX7R9BB104; Supplier Part Number: C111492
Q1 Q2 = CMP-1058-00781-1: Small Signal MOSFET, 60 V, 115 mA, N-Channel, 3-Pin SOT-23, Pb-Free, Tape and Reel; Manufacturer: On Semiconductor; Channel Polarity: N Channel; V(BR)DSS Min (V): 60; ID Max (A): 0.115; VGS Max (V): 20; Configuration: Single; VGS(th) Max (V): 2.5; ComponentLink1URL: http://www.onsemi.com/; ComponentLink3Description: Package Specification; ComponentLink3URL: http://www.onsemi.cn/pub_link/Collateral/318-08.PDF; PackageReference: SOT-23-3-318-08; RoHS: Pb-Free; ComponentLink2URL: http://www.onsemi.com/pub_link/Collateral/2N7002L-D.PDF; ComponentLink1Description: Manufacturer URL; Package Type: SOT-23-3; Packing: Tape and Reel; PartNumber: 2N7002LT1G; DatasheetVersion: Rev. 7; Mounting Technology: Surface Mount; ComponentLink2Description: Datasheet; PackageDescription: 3-Pin Small Outline Transistor, Body 2.92 x 1.3 mm, Pitch 0.95 mm; PackageVersion: Rev. AP, 11/2009
R37 R40 R41 R43 = CMP-016-000002-1: as R30 on sheet PGA; ConvertToPcb: yes; Datasheet: https://item.szlcsc.com/datasheet/0805W8F1002T5E/18102.html; Design Item ID: 0805W8F1002T5E; FootprintName: R0805; JLCPCB Part Class: Basic Part; LCSC Part Name: 10kΩ ±1% 125mW 厚膜电阻; Operating Temperature: -55℃~+155℃; Source: P1.SCHLIB; Supplier Footprint: 0805; Symbol: 0805W8F1002T5E; Temperature Coefficient: ±100ppm/℃; Type: Thick Film Resistor; Manufacturer Part Number: 0805W8F1002T5E; Supplier Part Number: C17414
R38 R39 R52 = CMP-016-000018-1: Type:Thick Film Resistor Resistance:0Ω Tolerance:±1% Tolerance:±1% Power(Watts):125mW Voltage-Supply(Max):150V Temperature Coefficient:±800ppm/℃ Temperature Coefficient:±800ppm/℃ Operating Temperature:-55℃~+155℃ Operating Temperature:-55℃~+155℃; Manufacturer: UNI-ROYAL(厚声); AddInBom: yes; ModelId: b83c7c5430874b8eb2319a65d9433429聨0819f05c4eef4c71ace90d822a990e87; ModelName: R0805_L2.0-W1.3-H0.6; ModelTransform: 78.74,51.181,0,0,0,0,0,-0.0005,0; Power(Watts): 125mW; Tolerance: 1%; Voltage-Supply(Max): 150V; ConvertToPcb: yes; Datasheet: https://item.szlcsc.com/datasheet/0805W8F0000T5E/18165.html; Design Item ID: 0805W8F0000T5E_C17477; Device: 0805W8F0000T5E_C17477; FootprintName: R0805; JLCPCB Part Class: Basic Part; LCSC Part Name: 0Ω ±1% 125mW 厚膜电阻; Operating Temperature: -55℃~+155℃; Source: P1.SCHLIB; Supplier Footprint: 0805; Symbol: 0805W8F0000T5E; Temperature Coefficient: ±800ppm/℃; Type: Thick Film Resistor; Manufacturer Part Number: 0805W8F0000T5E; Supplier Part Number: C17477
R42 R44 = CMP-016-000001-1: as R5 on sheet Analog_Input; ConvertToPcb: yes; Datasheet: https://atta.szlcsc.com/upload/public/pdf/source/20200306/C422600_1E6D84923E4A46A82E41ADD87F860B5C.pdf; Design Item ID: 0805W8F1001T5E; FootprintName: R0805; JLCPCB Part Class: Basic Part; LCSC Part Name: 1kΩ ±1% 125mW 厚膜电阻; Operating Temperature Range: -55℃~+155℃; Source: P1.SCHLIB; Supplier Footprint: 0805; Symbol: 0805W8F1001T5E; Temperature Coefficient: ±100ppm/℃; Type: Thick Film Resistors; Manufacturer Part Number: 0805W8F1001T5E; Supplier Part Number: C17513
U1 = CMP-00002-9: Operational Amplifier, 4 Func, 5000uV Offset-Max, CMOS, PDSO14; Max Supply Voltage: 7V; Number of Circuits: 4; Nominal Supply Voltage (DC): 3V; Input Offset Voltage (Vos): 5mV; Max Supply Current: 48mA; GAIN: 120Meg; Unity Gain Bandwidth Product: 120MHz; Common Mode Rejection Ratio: 45dB; Slew Rate: 160V/µs; Number of Terminals: 14; Terminal Pitch: 650µm; Max Operating Temperature: 125°C; Height - Seated (Max): 1.2mm; Length: 4.96mm; Min Operating Temperature: -40°C; RoHS: Compliant; Width: 4.4mm; Case/Package: TSSOP; Temperature Grade: Automotive
U8 = CMP-010-000000-2: Manufacturer: TI(德州仪器); AddInBom: yes; ModelTransform: 114.173,110.236,0,90,0,0,0,0,0; ModelName: SOT-23-3L_L2.9-W1.6-H1.1-LS2.8-P0.95; ModelId: 4eed685bb9f4439b846746bc2193f3c0ÂŽ0819f05c4eef4c71ace90d822a990e87; Device: REF3016EAIDBZR; Symbol: REF3016EAIDBZR; ConvertToPcb: yes; Supplier Footprint: SOT-23-3; FootprintName: SOT-23-3_L3.0-W1.7-P0.95-LS2.9-BR; JLCPCB Part Class: Extended Part; Source: schematic.SCHLIB; Design Item ID: REF3016EAIDBZR; LCSC Part Name: REF3016EAIDBZR; Manufacturer Part Number: REF3016EAIDBZR; Supplier Part Number: C54120489

## Sheet LPF.SchDoc
size A; SheetNumber: 4; SheetTotal: 6
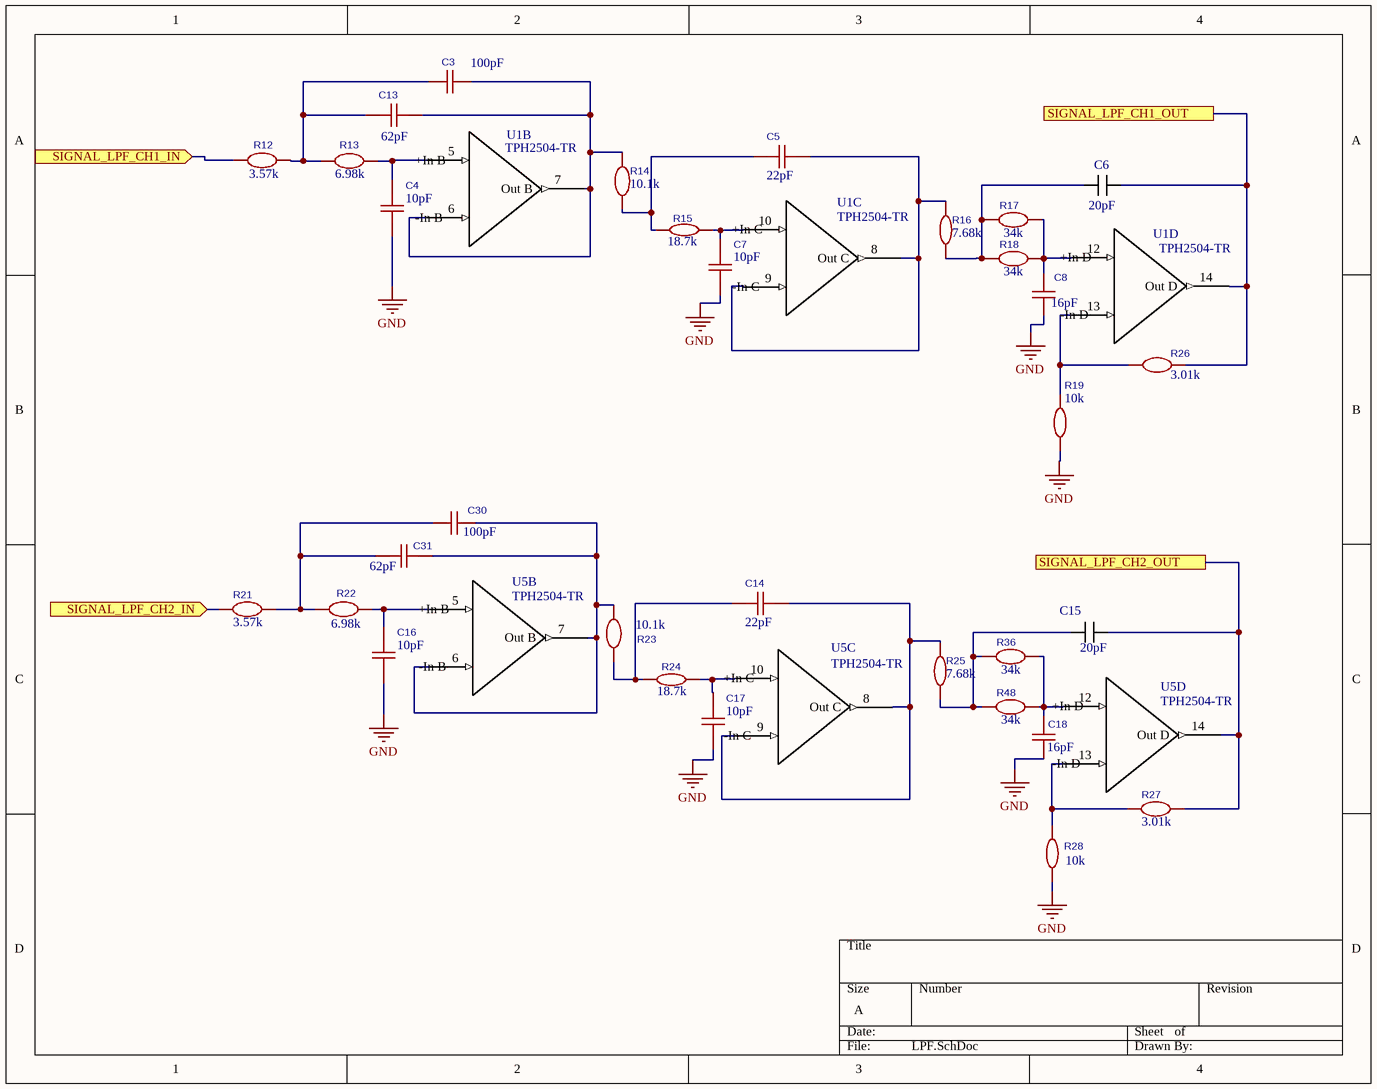
[diagram p3: LPF.SchDoc]

### Parts
C3  value 100pF  [C0603]  (hidden comment: CL10C101JB8NNNC)
C4  value 10pF  [C0805]  (hidden comment: VJ0805A100FXACW1BC)
C5  value 22pF  [C0805]  (hidden comment: TCC0805X5R226K100FT)
C6  value 20pF  [CAPCP2012X150N]  (hidden comment: Capacitor)
C7  value 10pF  [C0805]  (hidden comment: VJ0805A100FXACW1BC)
C8  value 16pF  [C0805]  (hidden comment: 0805CG6R0C500NT_C67560)
C13  value 62pF  [C0603]  (hidden comment: 0603CG620J500NT)
C14  value 22pF  [C0805]  (hidden comment: TCC0805X5R226K100FT)
C15  value 20pF  [CAPCP2012X150N]  (hidden comment: Capacitor)
C16  value 10pF  [C0805]  (hidden comment: VJ0805A100FXACW1BC)
C17  value 10pF  [C0805]  (hidden comment: VJ0805A100FXACW1BC)
C18  value 16pF  [C0805]  (hidden comment: 0805CG6R0C500NT_C67560)
C30  value 100pF  [C0603]  (hidden comment: CL10C101JB8NNNC)
C31  value 62pF  [C0603]  (hidden comment: 0603CG620J500NT)
R12  value 3.57k  [R0805]  (hidden comment: RT0805BRD0710K1L)
R13  value 6.98k  [R0805]  (hidden comment: RT0805BRD0710K1L)
R14  value 10.1k  [R0805]  (hidden comment: RT0805BRD0710K1L)
R15  value 18.7k  [R0805]  (hidden comment: 0805W8F0000T5E_C17477)
R16  value 7.68k  [R0805]  (hidden comment: 0805W8F0000T5E_C17477)
R17  value 34k  [R0805]  (hidden comment: FRC0805F3402TS)
R18  value 34k  [R0805]  (hidden comment: FRC0805F3402TS)
R19  value 10k  [R0805]  (hidden comment: 0805W8F0000T5E_C17477)
R21  value 3.57k  [R0805]  (hidden comment: RT0805BRD0710K1L)
R22  value 6.98k  [R0805]  (hidden comment: RT0805BRD0710K1L)
R23  value 10.1k  [R0805]  (hidden comment: RT0805BRD0710K1L)
R24  value 18.7k  [R0805]  (hidden comment: 0805W8F0000T5E_C17477)
R25  value 7.68k  [R0805]  (hidden comment: 0805W8F0000T5E_C17477)
R26  value 3.01k  [R0805]  (hidden comment: RT0805BRD0710K1L)
R27  value 3.01k  [R0805]  (hidden comment: RT0805BRD0710K1L)
R28  value 10k  [R0805]  (hidden comment: 0805W8F0000T5E_C17477)
R36  value 34k  [R0805]  (hidden comment: FRC0805F3402TS)
R48  value 34k  [R0805]  (hidden comment: FRC0805F3402TS)
U1  TPH2504-TR  [TSOP65P640X120-14N]  (parts B,C,D of 4)
U5  TPH2504-TR  [TSOP65P640X120-14N]  (parts B,C,D of 4)

### Ports
SIGNAL_LPF_CH1_IN (in, see PGA[3B]), SIGNAL_LPF_CH1_OUT (see H723ZG_Interface[1C], Trigger[2B]), SIGNAL_LPF_CH2_IN (in, see PGA[3C]), SIGNAL_LPF_CH2_OUT (see H723ZG_Interface[1C], Trigger[2A])

### Nets
GND: C4.1 C7.1 C8.2 C16.1 C17.1 C18.2 R19.1 R28.1
SIGNAL_LPF_CH1_IN: R12.1 ; port SIGNAL_LPF_CH1_IN
SIGNAL_LPF_CH1_OUT: C6.1 R26.2 ; port SIGNAL_LPF_CH1_OUT
SIGNAL_LPF_CH2_IN: R21.2 ; port SIGNAL_LPF_CH2_IN
SIGNAL_LPF_CH2_OUT: C15.1 R27.1 U5.14(Out_D) ; port SIGNAL_LPF_CH2_OUT
NetC3_1: C3.1 C13.1 R12.2 R13.1
NetC3_2: C3.2 C13.2 R14.2 U1.6(-In_B) U1.7(Out_B)
NetC4_2: C4.2 R13.2 U1.5(+In_B)
NetC5_1: C5.1 R14.1 R15.1
NetC5_2: C5.2 R16.2 U1.8(Out_C) U1.9(-In_C)
NetC6_2: C6.2 R16.1 R17.1 R18.1
NetC7_2: C7.2 R15.2 U1.10(+In_C)
NetC8_1: C8.1 R17.2 R18.2 U1.12(+In_D)
NetC14_1: C14.1 R23.2 R24.1
NetC14_2: C14.2 R25.2 U5.8(Out_C) U5.9(-In_C)
NetC15_2: C15.2 R25.1 R36.1 R48.1
NetC16_2: C16.2 R22.2 U5.5(+In_B)
NetC17_2: C17.2 R24.2 U5.10(+In_C)
NetC18_1: C18.1 R36.2 R48.2 U5.12(+In_D)
NetC30_1: C30.1 C31.1 R21.1 R22.1
NetC30_2: C30.2 C31.2 R23.1 U5.6(-In_B) U5.7(Out_B)
NetR19_2: R19.2 R26.1 U1.13(-In_D)
NetR27_2: R27.2 R28.2 U5.13(-In_D)

Not connected (* = marked no-connect by the designer): U1 14(Out_D)

### Library data of the parts
C3 C30 = CMP-015-000009-1: Capacitance:100pF Tolerance:±5% Tolerance:±5% Voltage Rating:50V Temperature Coefficient:C0G; Manufacturer: SAMSUNG(三星); Temperature Coefficient: C0G; Voltage Rating: 50V; ModelTransform: 62.992,31.496,0,0,0,0,0,0,0; Tolerance: 5%; ModelName: C0603_L1.6-W0.8-H0.8; ModelId: 624118aa3cc7497086c383c2d72e0852ÂŽ0819f05c4eef4c71ace90d822a990e87; ConvertToPcb: yes; Datasheet: https://item.szlcsc.com/datasheet/CL10C101JB8NNNC/15530.html; ManufacturerPart: CL10C101JB8NNNC; FootprintName: C0603; Device: CL10C101JB8NNNC; Design Item ID: CL10C101JB8NNNC; Supplier Footprint: 0603; Source: P1.SCHLIB; Symbol: CL10C101JB8NNNC; JLCPCB Part Class: Basic Part; SupplierPart: C14858; LCSC Part Name: 100pF ±5% 50V; AddInBom: yes
C4 C7 C16 C17 = CMP-015-000004-1: Capacitance:10pF Tolerance:±1% Tolerance:±1% Voltage Rating:50V Temperature Coefficient:C0G; Manufacturer: VISHAY(威世); AddInBom: yes; ModelId: 8c88e81f49c6409b980720ec8953afb6聨0819f05c4eef4c71ace90d822a990e87; ModelName: C0805_L2.0-W1.3-H1.3; ModelTransform: 78.74,51.181,0,0,0,0,0,0.0005,0; Temperature Coefficient: C0G; Tolerance: 1%; Voltage Rating: 50V; ConvertToPcb: yes; Datasheet: https://item.szlcsc.com/datasheet/VJ0805A100FXACW1BC/2269676.html; Design Item ID: VJ0805A100FXACW1BC; Device: VJ0805A100FXACW1BC; FootprintName: C0805; JLCPCB Part Class: Extended Part; LCSC Part Name: 10pF ±1% 50V; Source: P1.SCHLIB; Supplier Footprint: 0805; Symbol: VJ0805A100FXACW1BC; Manufacturer Part Number: VJ0805A100FXACW1BC; Supplier Part Number: C2177610
C5 C14 = CMP-015-000002-1: Capacitance:22pF Tolerance:±1% Tolerance:±1% Voltage Rating:50V Temperature Coefficient:C0G; Manufacturer: FH(风华); AddInBom: yes; Device: 0805CG220F500NT; ModelId: 8c88e81f49c6409b980720ec8953afb6聨0819f05c4eef4c71ace90d822a990e87; ModelName: C0805_L2.0-W1.3-H1.3; ModelTransform: 78.74,51.181,0,0,0,0,0,0.0005,0; Temperature Coefficient: C0G; Tolerance: 1%; Voltage Rating: 50V; ConvertToPcb: yes; Datasheet: https://item.szlcsc.com/datasheet/0805CG220F500NT/208470.html; Design Item ID: 0805CG220F500NT; FootprintName: C0805; JLCPCB Part Class: Extended Part; LCSC Part Name: 22pF ±1% 50V; Source: P1.SCHLIB; Supplier Footprint: 0805; Symbol: 0805CG220F500NT; Manufacturer Part Number: 0805CG220F500NT; Supplier Part Number: C190088
C6 C15 = CMP-00003-4: as C11 on sheet Analog_Input; Supplier Part Number: C5375851; Supplier: JLCPCB
C8 C18 = CMP-015-000001-1: Capacitance:16pF Tolerance:±5% Tolerance:±5% Voltage Rating:50V Temperature Coefficient:C0G; Manufacturer: FH(风华); AddInBom: yes; Device: 0805CG160J500NT; ModelId: 8c88e81f49c6409b980720ec8953afb6聨0819f05c4eef4c71ace90d822a990e87; ModelName: C0805_L2.0-W1.3-H1.3; ModelTransform: 78.74,51.181,0,0,0,0,0,0.0005,0; Temperature Coefficient: C0G; Tolerance: 5%; Voltage Rating: 50V; ConvertToPcb: yes; Datasheet: https://item.szlcsc.com/datasheet/0805CG160J500NT/2148.html; Design Item ID: 0805CG160J500NT; FootprintName: C0805; JLCPCB Part Class: Extended Part; LCSC Part Name: 16pF ±5% 50V; Source: P1.SCHLIB; Supplier Footprint: 0805; Symbol: 0805CG160J500NT; Manufacturer Part Number: 0805CG160J500NT; Supplier Part Number: C1796
C13 C31 = CMP-015-000008-1: Capacitance:62pF Tolerance:±5% Tolerance:±5% Voltage Rating:50V Temperature Coefficient:C0G; Manufacturer: FH(风华); Temperature Coefficient: C0G; ModelName: C0603_L1.6-W0.8-H0.8; Voltage Rating: 50V; AddInBom: yes; Tolerance: 5%; ModelId: 624118aa3cc7497086c383c2d72e0852ÂŽ0819f05c4eef4c71ace90d822a990e87; ModelTransform: 62.992,31.496,0,0,0,0,0,0,0; LCSC Part Name: 62pF ±5% 50V; Supplier Footprint: 0603; ManufacturerPart: 0603CG620J500NT; Device: 0603CG620J500NT; SupplierPart: C60732; Datasheet: https://item.szlcsc.com/datasheet/0603CG620J500NT/61784.html; Symbol: 0603CG620J500NT; Source: P1.SCHLIB; JLCPCB Part Class: Extended Part; Design Item ID: 0603CG620J500NT; FootprintName: C0603; ConvertToPcb: yes
R12 R21 = CMP-016-000012-1: Type:Thick Film Resistor Resistance:3.57kΩ Tolerance:±1% Tolerance:±1% Power(Watts):125mW Voltage-Supply(Max):150V Temperature Coefficient:±100ppm/℃ Temperature Coefficient:±100ppm/℃ Operating Temperature:-55℃~+155℃ Operating Temperature:-55℃~+155℃; Manufacturer: FOJAN(富捷); AddInBom: yes; Device: FRC0805F3571TS; ModelId: b83c7c5430874b8eb2319a65d9433429聨0819f05c4eef4c71ace90d822a990e87; ModelName: R0805_L2.0-W1.3-H0.6; ModelTransform: 78.74,51.181,0,0,0,0,0,-0.0005,0; Power(Watts): 125mW; Tolerance: 1%; Voltage-Supply(Max): 150V; ConvertToPcb: yes; Datasheet: https://item.szlcsc.com/datasheet/FRC0805F3571TS/3279527.html; Design Item ID: FRC0805F3571TS; FootprintName: R0805; JLCPCB Part Class: Extended Part; LCSC Part Name: 3.57kΩ ±1% 125mW 厚膜电阻; Operating Temperature: -55℃~+155℃; Source: P1.SCHLIB; Supplier Footprint: 0805; Symbol: FRC0805F3571TS; Temperature Coefficient: ±100ppm/℃; Type: Thick Film Resistor; Manufacturer Part Number: FRC0805F3571TS; Supplier Part Number: C2933425
R13 R22 = CMP-016-000014-1: Type:Thick Film Resistor Resistance:6.98kΩ Tolerance:±1% Tolerance:±1% Power(Watts):125mW Voltage-Supply(Max):150V Temperature Coefficient:±100ppm/℃ Temperature Coefficient:±100ppm/℃ Operating Temperature:-55℃~+155℃ Operating Temperature:-55℃~+155℃; Manufacturer: FOJAN(富捷); AddInBom: yes; Device: FRC0805F6981TS; ModelId: b83c7c5430874b8eb2319a65d9433429聨0819f05c4eef4c71ace90d822a990e87; ModelName: R0805_L2.0-W1.3-H0.6; ModelTransform: 78.74,51.181,0,0,0,0,0,-0.0005,0; Power(Watts): 125mW; Tolerance: 1%; Voltage-Supply(Max): 150V; ConvertToPcb: yes; Datasheet: https://item.szlcsc.com/datasheet/FRC0805F6981TS/3279591.html; Design Item ID: FRC0805F6981TS; FootprintName: R0805; JLCPCB Part Class: Extended Part; LCSC Part Name: 6.98kΩ ±1% 125mW 厚膜电阻; Operating Temperature: -55℃~+155℃; Source: P1.SCHLIB; Supplier Footprint: 0805; Symbol: FRC0805F6981TS; Temperature Coefficient: ±100ppm/℃; Type: Thick Film Resistor; Manufacturer Part Number: FRC0805F6981TS; Supplier Part Number: C2933489
R14 R23 = CMP-016-000017-1: Type:Thin Film Resistor Resistance:10.1kΩ Tolerance:±0.1% Tolerance:±0.1% Power(Watts):125mW Temperature Coefficient:±25ppm/℃ Temperature Coefficient:±25ppm/℃ Operating Temperature:-55℃~+155℃ Operating Temperature:-55℃~+155℃; Manufacturer: YAGEO(国巨); AddInBom: yes; ModelId: b83c7c5430874b8eb2319a65d9433429聨0819f05c4eef4c71ace90d822a990e87; ModelName: R0805_L2.0-W1.3-H0.6; ModelTransform: 78.74,51.181,0,0,0,0,0,-0.0005,0; Power(Watts): 125mW; Tolerance: 0.1%; ConvertToPcb: yes; Datasheet: https://item.szlcsc.com/datasheet/RT0805BRD0710K1L/925214.html; Design Item ID: RT0805BRD0710K1L; Device: RT0805BRD0710K1L; FootprintName: R0805; JLCPCB Part Class: Extended Part; LCSC Part Name: 薄膜电阻 10.1kΩ ±0.1% 125mW; Operating Temperature: -55℃~+155℃; Source: P1.SCHLIB; Supplier Footprint: 0805; Symbol: RT0805BRD0710K1L; Temperature Coefficient: ±25ppm/℃; Type: Thin Film Resistor; Manufacturer Part Number: RT0805BRD0710K1L; Supplier Part Number: C865133
R15 R24 = CMP-016-000004-1: Type:Thick Film Resistor Resistance:18.7kΩ Tolerance:±1% Tolerance:±1% Power(Watts):125mW Voltage-Supply(Max):150V Temperature Coefficient:±100ppm/℃ Temperature Coefficient:±100ppm/℃ Operating Temperature:-55℃~+155℃ Operating Temperature:-55℃~+155℃; Manufacturer: UNI-ROYAL(厚声); AddInBom: yes; Device: 0805W8F1872T5E; ModelId: b83c7c5430874b8eb2319a65d9433429聨0819f05c4eef4c71ace90d822a990e87; ModelName: R0805_L2.0-W1.3-H0.6; ModelTransform: 78.74,51.181,0,0,0,0,0,-0.0005,0; Power(Watts): 125mW; Tolerance: 1%; Voltage-Supply(Max): 150V; ConvertToPcb: yes; Datasheet: https://item.szlcsc.com/datasheet/0805W8F1872T5E/18187.html; Design Item ID: 0805W8F1872T5E; FootprintName: R0805; JLCPCB Part Class: Extended Part; LCSC Part Name: 18.7kΩ ±1% 125mW 厚膜电阻; Operating Temperature: -55℃~+155℃; Source: P1.SCHLIB; Supplier Footprint: 0805; Symbol: 0805W8F1872T5E; Temperature Coefficient: ±100ppm/℃; Type: Thick Film Resistor; Manufacturer Part Number: 0805W8F1872T5E; Supplier Part Number: C17499
R16 R25 = CMP-016-000016-1: Type:Thick Film Resistor Resistance:7.68kΩ Tolerance:±1% Tolerance:±1% Power(Watts):125mW Voltage-Supply(Max):150V Temperature Coefficient:±100ppm/℃ Temperature Coefficient:±100ppm/℃ Operating Temperature:-55℃~+155℃ Operating Temperature:-55℃~+155℃; Manufacturer: YAGEO(国巨); AddInBom: yes; Device: RC0805FR-077K68L; ModelId: b83c7c5430874b8eb2319a65d9433429聨0819f05c4eef4c71ace90d822a990e87; ModelName: R0805_L2.0-W1.3-H0.6; ModelTransform: 78.74,51.181,0,0,0,0,0,-0.0005,0; Power(Watts): 125mW; Tolerance: 1%; Voltage-Supply(Max): 150V; ConvertToPcb: yes; Datasheet: https://item.szlcsc.com/datasheet/RC0805FR-077K68L/262366.html; Design Item ID: RC0805FR-077K68L; FootprintName: R0805; JLCPCB Part Class: Extended Part; LCSC Part Name: 厚膜电阻 7.68kΩ ±1% 125mW; Operating Temperature: -55℃~+155℃; Source: P1.SCHLIB; Supplier Footprint: 0805; Symbol: RC0805FR-077K68L; Temperature Coefficient: ±100ppm/℃; Type: Thick Film Resistor; Manufacturer Part Number: RC0805FR-077K68L; Supplier Part Number: C273951
R17 R18 R36 R48 = CMP-016-000011-1: Type:Thick Film Resistor Resistance:34kΩ Tolerance:±1% Tolerance:±1% Power(Watts):125mW Voltage-Supply(Max):150V Temperature Coefficient:±100ppm/℃ Temperature Coefficient:±100ppm/℃ Operating Temperature:-55℃~+155℃ Operating Temperature:-55℃~+155℃; Manufacturer: FOJAN(富捷); ModelName: R0805_L2.0-W1.3-H0.6; Power(Watts): 125mW; ConvertToPcb: yes; Tolerance: 1%; ModelId: b83c7c5430874b8eb2319a65d9433429聨0819f05c4eef4c71ace90d822a990e87; ModelTransform: 78.74,51.181,0,0,0,0,0,-0.0005,0; Voltage-Supply(Max): 150V; Supplier Footprint: 0805; Type: Thick Film Resistor; Operating Temperature: -55℃~+155℃; Datasheet: https://item.szlcsc.com/datasheet/FRC0805F3402TS/3279522.html; AddInBom: yes; Temperature Coefficient: ±100ppm/℃; Source: P1.SCHLIB; Device: FRC0805F3402TS; LCSC Part Name: 34kΩ ±1% 125mW 厚膜电阻; FootprintName: R0805; Symbol: FRC0805F3402TS; JLCPCB Part Class: Extended Part; Design Item ID: FRC0805F3402TS; Manufacturer Part Number: FRC0805F3402TS; Supplier Part Number: C2933420
R19 R28 = CMP-016-000002-1: as R30 on sheet PGA; ConvertToPcb: yes; Datasheet: https://item.szlcsc.com/datasheet/0805W8F1002T5E/18102.html; Design Item ID: 0805W8F1002T5E; FootprintName: R0805; JLCPCB Part Class: Basic Part; LCSC Part Name: 10kΩ ±1% 125mW 厚膜电阻; Operating Temperature: -55℃~+155℃; Source: P1.SCHLIB; Supplier Footprint: 0805; Symbol: 0805W8F1002T5E; Temperature Coefficient: ±100ppm/℃; Type: Thick Film Resistor; Manufacturer Part Number: 0805W8F1002T5E; Supplier Part Number: C17414
R26 R27 = CMP-016-000010-1: Type:Thick Film Resistor Resistance:3.01kΩ Tolerance:±1% Tolerance:±1% Power(Watts):125mW Voltage-Supply(Max):150V Temperature Coefficient:±100ppm/℃ Temperature Coefficient:±100ppm/℃ Operating Temperature:-55℃~+155℃ Operating Temperature:-55℃~+155℃; Manufacturer: FOJAN(富捷); AddInBom: yes; Device: FRC0805F3011TS; ModelId: b83c7c5430874b8eb2319a65d9433429聨0819f05c4eef4c71ace90d822a990e87; ModelName: R0805_L2.0-W1.3-H0.6; ModelTransform: 78.74,51.181,0,0,0,0,0,-0.0005,0; Power(Watts): 125mW; Tolerance: 1%; Voltage-Supply(Max): 150V; ConvertToPcb: yes; Datasheet: https://item.szlcsc.com/datasheet/FRC0805F3011TS/3476925.html; Design Item ID: FRC0805F3011TS; FootprintName: R0805; JLCPCB Part Class: Extended Part; LCSC Part Name: 3.01kΩ ±1% 125mW 厚膜电阻; Operating Temperature: -55℃~+155℃; Source: P1.SCHLIB; Supplier Footprint: 0805; Symbol: FRC0805F3011TS; Temperature Coefficient: ±100ppm/℃; Type: Thick Film Resistor; Manufacturer Part Number: FRC0805F3011TS; Supplier Part Number: C2999485
U1 U5 = CMP-00002-9: as U1 on sheet REF_VOLTAGE_RELAY_DRIVER; Number of Terminals: 14; Terminal Pitch: 650µm; Max Operating Temperature: 125°C; Height - Seated (Max): 1.2mm; Length: 4.96mm; Min Operating Temperature: -40°C; RoHS: Compliant; Width: 4.4mm; Case/Package: TSSOP; Temperature Grade: Automotive